# Altium schematic sheet SIX-INPORT.SchDoc
size A3
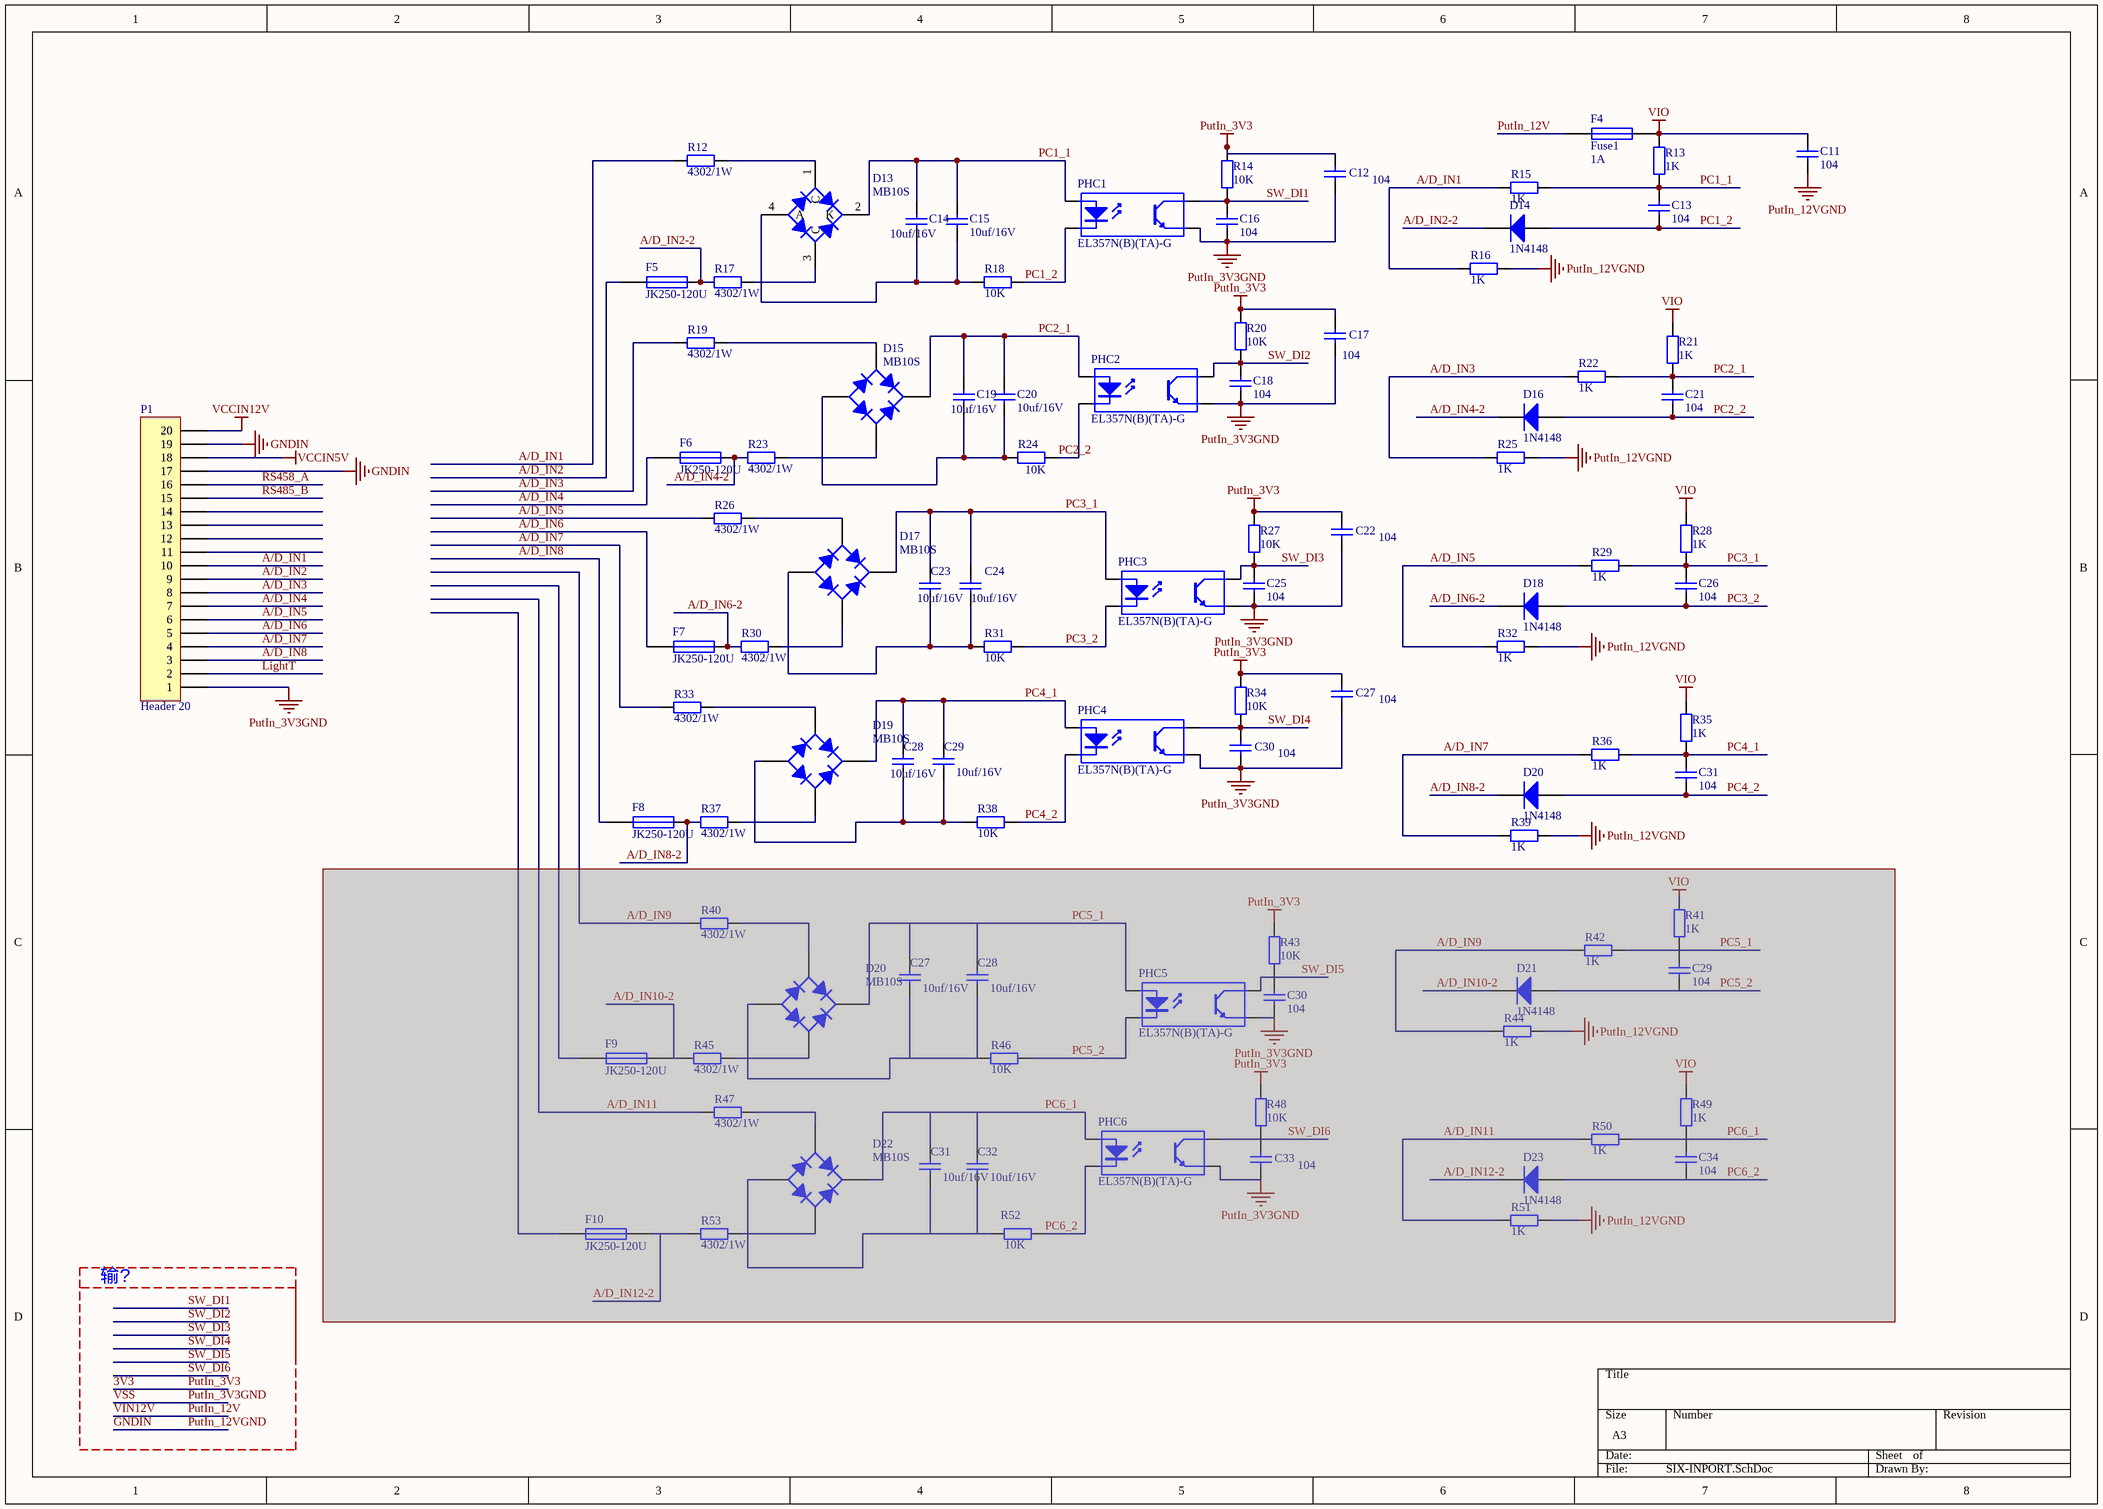
[diagram p0: SIX-INPORT.SchDoc]

## Parts
(Parts that share a designator on the sheet are numbered #1, #2 ... from top to bottom, then left to right.)
C11  104  [LC-0805_C]
C12  104  [LC-0603_C]
C13  104  [LC-0805_C]
C14  10uf/16V  [LC-0805_C]
C15  10uf/16V  [LC-0805_C]
C16  104  [LC-0603_C]
C17  104  [LC-0603_C]
C18  104  [LC-0603_C]
C19  10uf/16V  [LC-0805_C]
C20  10uf/16V  [LC-0805_C]
C21  104  [LC-0805_C]
C22  104  [LC-0603_C]
C23  10uf/16V  [LC-0805_C]
C24  10uf/16V  [LC-0805_C]
C25  104  [LC-0603_C]
C26  104  [LC-0805_C]
C27#1  104  [LC-0603_C]
C27#2  10uf/16V  [LC-0805_C]  (masked out: inside a compile mask, not in the netlist)
C28#1  10uf/16V  [LC-0805_C]
C28#2  10uf/16V  [LC-0805_C]  (masked out: inside a compile mask, not in the netlist)
C29#1  10uf/16V  [LC-0805_C]
C29#2  104  [LC-0805_C]  (masked out: inside a compile mask, not in the netlist)
C30#1  104  [LC-0603_C]
C30#2  104  [LC-0603_C]  (masked out: inside a compile mask, not in the netlist)
C31#1  104  [LC-0805_C]
C31#2  10uf/16V  [LC-0805_C]  (masked out: inside a compile mask, not in the netlist)
C32  10uf/16V  [LC-0805_C]  (masked out: inside a compile mask, not in the netlist)
C33  104  [LC-0603_C]  (masked out: inside a compile mask, not in the netlist)
C34  104  [LC-0805_C]  (masked out: inside a compile mask, not in the netlist)
D13  MB10S  [LC-MBS]
D14  1N4148  [LC-SOD-123]
D15  MB10S  [LC-MBS]
D16  1N4148  [LC-SOD-123]
D17  MB10S  [LC-MBS]
D18  1N4148  [LC-SOD-123]
D19  MB10S  [LC-MBS]
D20#1  1N4148  [LC-SOD-123]
D20#2  MB10S  [LC-MBS]  (masked out: inside a compile mask, not in the netlist)
D21  1N4148  [LC-SOD-123]  (masked out: inside a compile mask, not in the netlist)
D22  MB10S  [LC-MBS]  (masked out: inside a compile mask, not in the netlist)
D23  1N4148  [LC-SOD-123]  (masked out: inside a compile mask, not in the netlist)
F4  Fuse1  value 1A  [0805-1]
F5  JK250-120U  [ntc250v]
F6  JK250-120U  [ntc250v]
F7  JK250-120U  [ntc250v]
F8  JK250-120U  [ntc250v]
F9  JK250-120U  [ntc250v]  (masked out: inside a compile mask, not in the netlist)
F10  JK250-120U  [ntc250v]  (masked out: inside a compile mask, not in the netlist)
P1  Header 20  [HDR_5.0_20P]
PHC1  EL357N(B)(TA)-G  [LC-SOP-4_P2.54]
PHC2  EL357N(B)(TA)-G  [LC-SOP-4_P2.54]
PHC3  EL357N(B)(TA)-G  [LC-SOP-4_P2.54]
PHC4  EL357N(B)(TA)-G  [LC-SOP-4_P2.54]
PHC5  EL357N(B)(TA)-G  [LC-SOP-4_P2.54]  (masked out: inside a compile mask, not in the netlist)
PHC6  EL357N(B)(TA)-G  [LC-SOP-4_P2.54]  (masked out: inside a compile mask, not in the netlist)
R12  4302/1W  [1812]
R13  value 1K  [0805-1]  (hidden comment: Res1)
R14  10K  [LC-0603_R]
R15  value 1K  [0805-1]  (hidden comment: Res1)
R16  value 1K  [0805-1]  (hidden comment: Res1)
R17  4302/1W  [1812]
R18  10K  [LC-0603_R]
R19  4302/1W  [1812]
R20  10K  [LC-0603_R]
R21  value 1K  [0805-1]  (hidden comment: Res1)
R22  value 1K  [0805-1]  (hidden comment: Res1)
R23  4302/1W  [1812]
R24  10K  [LC-0603_R]
R25  value 1K  [0805-1]  (hidden comment: Res1)
R26  4302/1W  [1812]
R27  10K  [LC-0603_R]
R28  value 1K  [0805-1]  (hidden comment: Res1)
R29  value 1K  [0805-1]  (hidden comment: Res1)
R30  4302/1W  [1812]
R31  10K  [LC-0603_R]
R32  value 1K  [0805-1]  (hidden comment: Res1)
R33  4302/1W  [1812]
R34  10K  [LC-0603_R]
R35  value 1K  [0805-1]  (hidden comment: Res1)
R36  value 1K  [0805-1]  (hidden comment: Res1)
R37  4302/1W  [1812]
R38  10K  [LC-0603_R]
R39  value 1K  [0805-1]  (hidden comment: Res1)
R40  4302/1W  [1812]  (masked out: inside a compile mask, not in the netlist)
R41  value 1K  [0805-1]  (hidden comment: Res1)  (masked out: inside a compile mask, not in the netlist)
R42  value 1K  [0805-1]  (hidden comment: Res1)  (masked out: inside a compile mask, not in the netlist)
R43  10K  [LC-0603_R]  (masked out: inside a compile mask, not in the netlist)
R44  value 1K  [0805-1]  (hidden comment: Res1)  (masked out: inside a compile mask, not in the netlist)
R45  4302/1W  [1812]  (masked out: inside a compile mask, not in the netlist)
R46  10K  [LC-0603_R]  (masked out: inside a compile mask, not in the netlist)
R47  4302/1W  [1812]  (masked out: inside a compile mask, not in the netlist)
R48  10K  [LC-0603_R]  (masked out: inside a compile mask, not in the netlist)
R49  value 1K  [0805-1]  (hidden comment: Res1)  (masked out: inside a compile mask, not in the netlist)
R50  value 1K  [0805-1]  (hidden comment: Res1)  (masked out: inside a compile mask, not in the netlist)
R51  value 1K  [0805-1]  (hidden comment: Res1)  (masked out: inside a compile mask, not in the netlist)
R52  10K  [LC-0603_R]  (masked out: inside a compile mask, not in the netlist)
R53  4302/1W  [1812]  (masked out: inside a compile mask, not in the netlist)

## Nets
3V3: C12.1 C17.1 C22.1 C27#1.1 R14.2 R20.2 R27.2 R34.2  [also labelled PutIn_3V3]
GNDIN: C11.1 P1.17 P1.19 R16.1 R25.1 R32.1 R39.1  [also labelled PutIn_12VGND]
PutIn_3V3GND: C12.2 C16.2 C17.2 C18.2 C22.2 C25.2 C27#1.2 C30#1.2 P1.1 PHC1.3(E) PHC2.3(E) PHC3.3(E) PHC4.3(E)  [also labelled VSS]
VCCIN5V: P1.18
VCCIN12V: P1.20
VIO: C11.2 F4.2 R13.2 R21.1 R28.1 R35.1
A/D_IN1: P1.10 R12.1 R15.2 R16.2
A/D_IN2: F5.1 P1.9
A/D_IN2-2: D14.2(K) F5.2 R17.1
A/D_IN3: P1.8 R19.1 R22.2 R25.2
A/D_IN4: F6.1 P1.7
A/D_IN4-2: D16.2(K) F6.2 R23.1
A/D_IN5: P1.6 R26.1 R29.2 R32.2
A/D_IN6: F7.1 P1.5
A/D_IN6-2: D18.2(K) F7.2 R30.1
A/D_IN7: P1.4 R33.1 R36.2 R39.2
A/D_IN8: F8.1 P1.3
A/D_IN8-2: D20#1.2(K) F8.2 R37.1
LightT: P1.2
PC1_1: C13.1 C14.2 C15.2 D13.2(K) PHC1.1(A) R13.1 R15.1
PC1_2: C13.2 D14.1(A) PHC1.2(K) R18.1
PC2_1: C19.2 C20.2 C21.1 D15.2(K) PHC2.1(A) R21.2 R22.1
PC2_2: C21.2 D16.1(A) PHC2.2(K) R24.1
PC3_1: C23.2 C24.2 C26.1 D17.2(K) PHC3.1(A) R28.2 R29.1
PC3_2: C26.2 D18.1(A) PHC3.2(K) R31.1
PC4_1: C28#1.2 C29#1.2 C31#1.1 D19.2(K) PHC4.1(A) R35.2 R36.1
PC4_2: C31#1.2 D20#1.1(A) PHC4.2(K) R38.1
PutIn_12V: F4.1  [also labelled VIN12V]
RS458_A: P1.16
RS485_B: P1.15
SW_DI1: C16.1 PHC1.4(C) R14.1
SW_DI2: C18.1 PHC2.4(C) R20.1
SW_DI3: C25.1 PHC3.4(C) R27.1
SW_DI4: C30#1.1 PHC4.4(C) R34.1
NetC14_1: C14.1 C15.1 D13.4(A) R18.2
NetC19_1: C19.1 C20.1 D15.4(A) R24.2
NetC23_1: C23.1 C24.1 D17.4(A) R31.2
NetC28#1_1: C28#1.1 C29#1.1 D19.4(A) R38.2
NetD13_1: D13.1(C) R12.2
NetD13_3: D13.3(C) R17.2
NetD15_1: D15.1(C) R19.2
NetD15_3: D15.3(C) R23.2
NetD17_1: D17.1(C) R26.2
NetD17_3: D17.3(C) R30.2
NetD19_1: D19.1(C) R33.2
NetD19_3: D19.3(C) R37.2

Not connected (* = marked no-connect by the designer): P1 11 12 13 14

## Notes on the sheet
- 输?

## Library data of the parts
C11 C12 C14-C20 C22-C25 C27#1 C27#2 C28#1 C28#2 C29#1 C30#1 C30#2 C31#2 C32 C33 = Cap: Capacitor; Value: 100pF; Published: 8-Jun-2000; LatestRevisionDate: 17-Jul-2002; LatestRevisionNote: Re-released for DXP Platform.; PackageReference: RAD-0.3; Publisher: Altium Limited; PackageDescription: Radial Cap, Thru-Hole; 2 Leads; 0.3 in Pin Spacing
C13 C21 C26 C29#2 C31#1 C34 = Cap: Capacitor; Value: 100nF; Published: 8-Jun-2000; Revision: July-2002: Re-released for DXP Platform.; Publisher: Altium Limited
D13 D15 D17 D19 D20#2 D22 = MBS: 整流桥; ComponentLink1Description: 供应商链接; ComponentLink1URL: http://www.szlcsc.com/product/details_2865.html; Package: MBS; Supplier: LC; SuppliersPartNumber: C2488
D14 D16 D18 D20#1 D21 D23 = Diode: Default Diode; Published: 8-Jun-2000; LatestRevisionDate: 17-Jul-2002; LatestRevisionNote: Re-released for DXP Platform.; PackageDocument: Sep-1996; PackageReference: SMC; Publisher: Altium Limited; Code_JEDEC: DO-214-AB
F4 = F: 保险丝
F5-F10 = Fuse1: 保险丝; Value: 1A
P1 = Header 20: Header, 20-Pin; LatestRevisionDate: 17-Jul-2002; LatestRevisionNote: Re-released for DXP Platform.; Publisher: Altium Limited
PHC1-PHC6 = EL357N: 贴片光耦; ComponentLink1Description: 供应商链接; ComponentLink1URL: http://www.szlcsc.com/product/details_7114.html; Package: SOP-4_P2.54; Supplier: LC; SuppliersPartNumber: C6649
R12 R14 R17-R20 R23 R24 R26 R27 R30 R31 R33 R34 R37 R38 R40 R43 R45-R48 R52 R53 = Res2: Resistor; Value: 1K; Published: 8-Jun-2000; LatestRevisionDate: 17-Jul-2002; LatestRevisionNote: Re-released for DXP Platform.; PackageReference: AXIAL-0.4; Publisher: Altium Limited; PackageDescription: Axial Device, Thru-Hole; 2 Leads; 0.4 in Pin Spacing
R13 R15 R16 R21 R22 R25 R28 R29 R32 R35 R36 R39 R41 R42 R44 R49-R51 = R: 贴片电阻; Published: 8-Jun-2000; LatestRevisionDate: 17-Jul-2002; LatestRevisionNote: Re-released for DXP Platform.; PackageReference: AXIAL-0.4; Publisher: Altium Limited